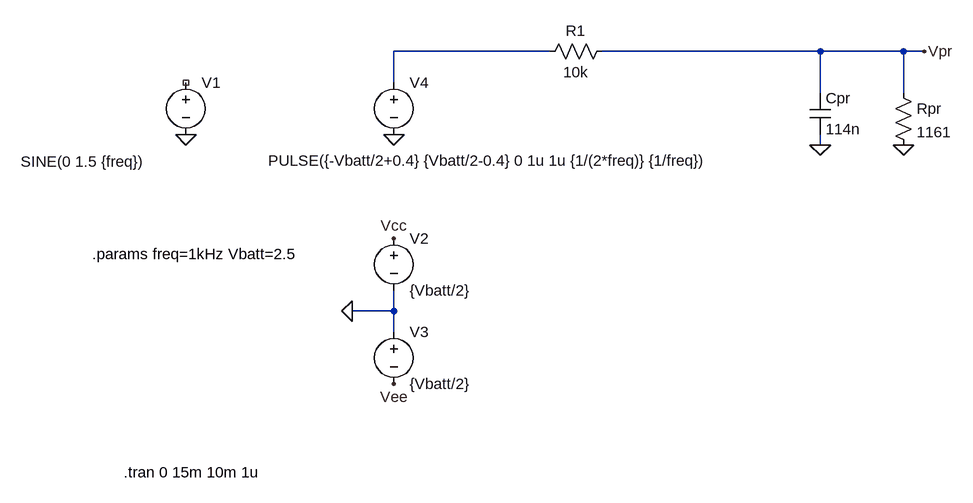
[diagram p0: schematic elnTest.asc]
elnTest.asc, the LTspice schematic file:
Version 4
SHEET 1 1380 680
WIRE 576 16 336 16
WIRE 992 16 656 16
WIRE 1120 16 992 16
WIRE 1152 16 1120 16
WIRE 336 64 336 16
WIRE 992 80 992 16
WIRE 1120 80 1120 16
WIRE 992 160 992 144
WIRE 336 416 336 384
WIRE 336 416 272 416
WIRE 336 448 336 416
FLAG 336 144 0
FLAG 992 160 0
FLAG 1120 160 0
FLAG 272 416 0
FLAG 16 144 0
FLAG 336 304 Vcc
FLAG 336 528 Vee
FLAG 1152 16 Vpr
SYMBOL voltage 16 48 R0
WINDOW 3 -254 138 Left 2
WINDOW 123 0 0 Left 0
WINDOW 39 0 0 Left 0
SYMATTR Value SINE(0 1.5 {freq})
SYMATTR InstName V1
SYMBOL voltage 336 288 R0
SYMATTR InstName V2
SYMATTR Value {Vbatt/2}
SYMBOL voltage 336 432 R0
SYMATTR InstName V3
SYMATTR Value {Vbatt/2}
SYMBOL voltage 336 48 R0
WINDOW 3 -193 136 Left 2
WINDOW 123 0 0 Left 0
WINDOW 39 0 0 Left 0
SYMATTR Value PULSE({-Vbatt/2+0.4} {Vbatt/2-0.4} 0 1u 1u {1/(2*freq)} {1/freq})
SYMATTR InstName V4
SYMBOL res 672 0 R90
WINDOW 0 0 56 VBottom 2
WINDOW 3 32 56 VTop 2
SYMATTR InstName R1
SYMATTR Value 10k
SYMBOL res 1104 64 R0
SYMATTR InstName Rpr
SYMATTR Value 1161
SYMBOL cap 976 80 R0
SYMATTR InstName Cpr
SYMATTR Value 114n
TEXT -128 328 Left 2 !.params freq=1kHz Vbatt=2.5
TEXT -80 664 Left 2 !.tran 0 15m 10m 1u

The netlist it stands for:
* elnTest.asc
V1 NC_01 0 SINE(0 1.5 {freq})
V2 Vcc 0 {Vbatt/2}
V3 0 Vee {Vbatt/2}
V4 N001 0 PULSE({-Vbatt/2+0.4} {Vbatt/2-0.4} 0 1u 1u {1/(2*freq)} {1/freq})
R1 Vpr N001 10k
Rpr Vpr 0 1161
Cpr Vpr 0 114n
.params freq=1kHz Vbatt=2.5
.tran 0 15m 10m 1u
.backanno
.end